# Altium schematic sheet fpga ram V0.SchDoc
size A4; Organization: Blinkinlabs, LLC
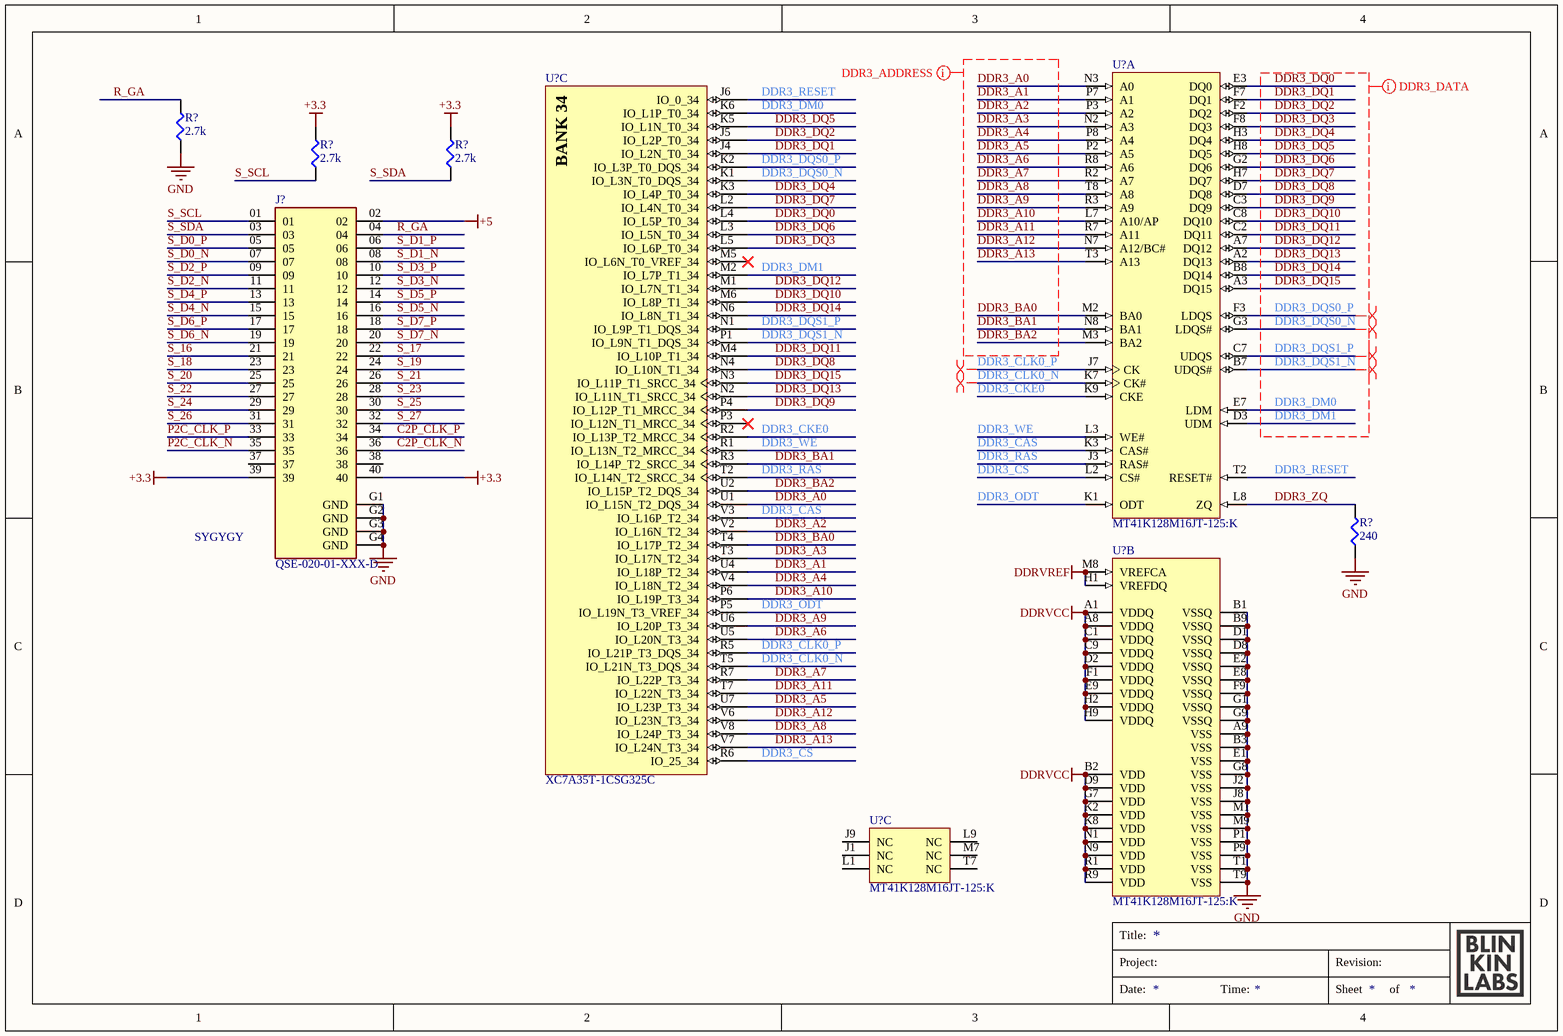
[diagram p0: fpga ram V0.SchDoc]

## Parts
(Parts that share a designator on the sheet are numbered #1, #2 ... from top to bottom, then left to right.)
J?  QSE-020-01-XXX-D  [SAMTEC_QSE-020-01-XXX-D]
R?#1  2.7k  [ERJ2G(0402)_L]
R?#2  2.7k  [ERJ2G(0402)_L]
R?#3  2.7k  [ERJ2G(0402)_L]
R?#4  240  [ERJ2G(0402)_L]
U?#1  MT41K128M16JT-125:K  [MICT-JT-96]  (part A of 3)
U?#2  XC7A35T-1CSG325C  [CSG325]  (part C of 9)
U?#3  MT41K128M16JT-125:K  [MICT-JT-96]  (part B of 3)
U?#4  MT41K128M16JT-125:K  [MICT-JT-96]  (part C of 3)

## Nets
+3.3: J?.39 J?.40 R?#2.2 R?#3.2
+5: J?.02
DDRVCC: U?#3.A1(VDDQ) U?#3.A8(VDDQ) U?#3.B2(VDD) U?#3.C1(VDDQ) U?#3.C9(VDDQ) U?#3.D2(VDDQ) U?#3.D9(VDD) U?#3.E9(VDDQ) U?#3.F1(VDDQ) U?#3.G7(VDD) U?#3.H2(VDDQ) U?#3.H9(VDDQ) U?#3.K2(VDD) U?#3.K8(VDD) U?#3.N1(VDD) U?#3.N9(VDD) U?#3.R1(VDD) U?#3.R9(VDD)
DDRVREF: U?#3.H1(VREFDQ) U?#3.M8(VREFCA)
GND: J?.G1(GND) J?.G2(GND) J?.G3(GND) J?.G4(GND) R?#1.1 R?#4.1 U?#3.A9(VSS) U?#3.B1(VSSQ) U?#3.B3(VSS) U?#3.B9(VSSQ) U?#3.D1(VSSQ) U?#3.D8(VSSQ) U?#3.E1(VSS) U?#3.E2(VSSQ) U?#3.E8(VSSQ) U?#3.F9(VSSQ) U?#3.G1(VSSQ) U?#3.G8(VSS) U?#3.G9(VSSQ) U?#3.J2(VSS) U?#3.J8(VSS) U?#3.M1(VSS) U?#3.M9(VSS) U?#3.P1(VSS) U?#3.P9(VSS) U?#3.T1(VSS) U?#3.T9(VSS)
C2P_CLK_N: J?.36
C2P_CLK_P: J?.34
DDR3_A0: U?#1.N3(A0) U?#2.U1(IO_L15N_T2_DQS_34)
DDR3_A1: U?#1.P7(A1) U?#2.U4(IO_L18P_T2_34)
DDR3_A2: U?#1.P3(A2) U?#2.V2(IO_L16N_T2_34)
DDR3_A3: U?#1.N2(A3) U?#2.T3(IO_L17N_T2_34)
DDR3_A4: U?#1.P8(A4) U?#2.V4(IO_L18N_T2_34)
DDR3_A5: U?#1.P2(A5) U?#2.U7(IO_L23P_T3_34)
DDR3_A6: U?#1.R8(A6) U?#2.U5(IO_L20N_T3_34)
DDR3_A7: U?#1.R2(A7) U?#2.R7(IO_L22P_T3_34)
DDR3_A8: U?#1.T8(A8) U?#2.V8(IO_L24P_T3_34)
DDR3_A9: U?#1.R3(A9) U?#2.U6(IO_L20P_T3_34)
DDR3_A10: U?#1.L7(A10/AP) U?#2.P6(IO_L19P_T3_34)
DDR3_A11: U?#1.R7(A11) U?#2.T7(IO_L22N_T3_34)
DDR3_A12: U?#1.N7(A12/BC#) U?#2.V6(IO_L23N_T3_34)
DDR3_A13: U?#1.T3(A13) U?#2.V7(IO_L24N_T3_34)
DDR3_BA0: U?#1.M2(BA0) U?#2.T4(IO_L17P_T2_34)
DDR3_BA1: U?#1.N8(BA1) U?#2.R3(IO_L14P_T2_SRCC_34)
DDR3_BA2: U?#1.M3(BA2) U?#2.U2(IO_L15P_T2_DQS_34)
DDR3_CAS: U?#1.K3(CAS#) U?#2.V3(IO_L16P_T2_34)
DDR3_CKE0: U?#1.K9(CKE) U?#2.R2(IO_L13P_T2_MRCC_34)
DDR3_CLK0_N: U?#1.K7(CK#) U?#2.T5(IO_L21N_T3_DQS_34)
DDR3_CLK0_P: U?#1.J7(CK) U?#2.R5(IO_L21P_T3_DQS_34)
DDR3_CS: U?#1.L2(CS#) U?#2.R6(IO_25_34)
DDR3_DM0: U?#1.E7(LDM) U?#2.K6(IO_L1P_T0_34)
DDR3_DM1: U?#1.D3(UDM) U?#2.M2(IO_L7P_T1_34)
DDR3_DQ0: U?#1.E3(DQ0) U?#2.L4(IO_L5P_T0_34)
DDR3_DQ1: U?#1.F7(DQ1) U?#2.J4(IO_L2N_T0_34)
DDR3_DQ2: U?#1.F2(DQ2) U?#2.J5(IO_L2P_T0_34)
DDR3_DQ3: U?#1.F8(DQ3) U?#2.L5(IO_L6P_T0_34)
DDR3_DQ4: U?#1.H3(DQ4) U?#2.K3(IO_L4P_T0_34)
DDR3_DQ5: U?#1.H8(DQ5) U?#2.K5(IO_L1N_T0_34)
DDR3_DQ6: U?#1.G2(DQ6) U?#2.L3(IO_L5N_T0_34)
DDR3_DQ7: U?#1.H7(DQ7) U?#2.L2(IO_L4N_T0_34)
DDR3_DQ8: U?#1.D7(DQ8) U?#2.N4(IO_L10N_T1_34)
DDR3_DQ9: U?#1.C3(DQ9) U?#2.P4(IO_L12P_T1_MRCC_34)
DDR3_DQ10: U?#1.C8(DQ10) U?#2.M6(IO_L8P_T1_34)
DDR3_DQ11: U?#1.C2(DQ11) U?#2.M4(IO_L10P_T1_34)
DDR3_DQ12: U?#1.A7(DQ12) U?#2.M1(IO_L7N_T1_34)
DDR3_DQ13: U?#1.A2(DQ13) U?#2.N2(IO_L11N_T1_SRCC_34)
DDR3_DQ14: U?#1.B8(DQ14) U?#2.N6(IO_L8N_T1_34)
DDR3_DQ15: U?#1.A3(DQ15) U?#2.N3(IO_L11P_T1_SRCC_34)
DDR3_DQS0_N: U?#1.G3(LDQS#) U?#2.K1(IO_L3N_T0_DQS_34)
DDR3_DQS0_P: U?#1.F3(LDQS) U?#2.K2(IO_L3P_T0_DQS_34)
DDR3_DQS1_N: U?#1.B7(UDQS#) U?#2.P1(IO_L9N_T1_DQS_34)
DDR3_DQS1_P: U?#1.C7(UDQS) U?#2.N1(IO_L9P_T1_DQS_34)
DDR3_ODT: U?#1.K1(ODT) U?#2.P5(IO_L19N_T3_VREF_34)
DDR3_RAS: U?#1.J3(RAS#) U?#2.T2(IO_L14N_T2_SRCC_34)
DDR3_RESET: U?#1.T2(RESET#) U?#2.J6(IO_0_34)
DDR3_WE: U?#1.L3(WE#) U?#2.R1(IO_L13N_T2_MRCC_34)
DDR3_ZQ: R?#4.2 U?#1.L8(ZQ)
P2C_CLK_N: J?.35
P2C_CLK_P: J?.33
R_GA: J?.04 R?#1.2
S_16: J?.21
S_17: J?.22
S_18: J?.23
S_19: J?.24
S_20: J?.25
S_21: J?.26
S_22: J?.27
S_23: J?.28
S_24: J?.29
S_25: J?.30
S_26: J?.31
S_27: J?.32
S_D0_N: J?.07
S_D0_P: J?.05
S_D1_N: J?.08
S_D1_P: J?.06
S_D2_N: J?.11
S_D2_P: J?.09
S_D3_N: J?.12
S_D3_P: J?.10
S_D4_N: J?.15
S_D4_P: J?.13
S_D5_N: J?.16
S_D5_P: J?.14
S_D6_N: J?.19
S_D6_P: J?.17
S_D7_N: J?.20
S_D7_P: J?.18
S_SCL: J?.01 R?#2.1
S_SDA: J?.03 R?#3.1

Not connected (* = marked no-connect by the designer): J? 37 38; U?#2 M5(IO_L6N_T0_VREF_34)* P3(IO_L12N_T1_MRCC_34)*; U?#4 J1(NC) J9(NC) L1(NC) L9(NC) M7(NC) T7(NC)

## Layout directives
net class DDR3_ADDRESS: DDR3_A0, DDR3_A1, DDR3_A2, DDR3_A3, DDR3_A4, DDR3_A5, DDR3_A6, DDR3_A7, DDR3_A8, DDR3_A9, DDR3_A10, DDR3_A11, DDR3_A12, DDR3_A13, DDR3_BA0, DDR3_BA1, DDR3_BA2
net class DDR3_DATA; rule Matched Net Lengths [Delay Tolerance = 15ps]; rule Impedance Constraint [Min = 50.00    Max = 50.00    ]: DDR3_DM0, DDR3_DM1, DDR3_DQ0, DDR3_DQ1, DDR3_DQ2, DDR3_DQ3, DDR3_DQ4, DDR3_DQ5, DDR3_DQ6, DDR3_DQ7, DDR3_DQ8, DDR3_DQ9, DDR3_DQ10, DDR3_DQ11, DDR3_DQ12, DDR3_DQ13, DDR3_DQ14, DDR3_DQ15, DDR3_DQS0_N, DDR3_DQS0_P, DDR3_DQS1_N, DDR3_DQS1_P
differential pair: DDR3_CLK0_N, DDR3_CLK0_P, DDR3_DQS0_N, DDR3_DQS0_P, DDR3_DQS1_N, DDR3_DQS1_P

## Notes on the sheet
- (near J?) SYGYGY
- Title:
- Project:
- Revision:
- Date:
- Time:
- Sheet
- of
- (in symbol CMP-0383-00016-1, part C) BANK 34

## Library data of the parts
J? = QSE-020-01-XXX-D: 40 Position Connector Receptacle, Center Strip Contacts Surface Mount Gold; MF: Samtec; MP: QSE-020-01-F-D; SnapEDA_Link: https://www.snapeda.com/parts/QSE-020-01-F-D/Samtec/view-part/1737145/?ref=snap; Value: *; Availability: Bad; Price: None; Toby_UK-Purchase-URL: https://snapeda.com/shop?store=Toby+UK&id=1737145; Package: MAPBGA-624 Samtec
R?#1-R?#3 = ERJ-2RKF2701X: RES SMD 2.7K OHM 1% 1/10W 0402; Manufacturer: Panasonic Electronic Components; Power (Watts): 0.1W, 1/10W; Temperature Coefficient: ±100ppm/°C; PartNumber: ERJ-2RKF2701X; Datasheets: http://industrial.panasonic.com/www-cgi/jvcr13pz.cgi?E+PZ+3+AOA0002+ERJ2RKF2701X+7+WW; Image: //media.digikey.com/Photos/Panasonic%20Photos/ERJ-PA2-Series.jpg; Digi-Key Part Number: P2.70KLCT-ND; Series: ERJ; Value: 2.7k; Tolerance: ±1%; Composition: Thick Film; Features: Automotive AEC-Q200; Operating Temperature: -55°C ~ 155°C; Package / Case: 0402 (1005 Metric); Case/Package: 0402; Size / Dimension: 0.039" L x 0.020" W (1.00mm x 0.50mm); Height - Seated (Max): 0.016" (0.40mm); Number of Terminations: 2
R?#4 = ERJ-2RKF2400X: RES SMD 240 OHM 1% 1/10W 0402; Manufacturer: Panasonic Electronic Components; Power (Watts): 0.1W, 1/10W; Temperature Coefficient: ±100ppm/°C; PartNumber: ERJ-2RKF2400X; Datasheets: http://industrial.panasonic.com/www-cgi/jvcr13pz.cgi?E+PZ+3+AOA0002+ERJ2RKF2400X+7+WW; Image: //media.digikey.com/Photos/Panasonic%20Photos/ERJ-PA2-Series.jpg; Digi-Key Part Number: P240LCT-ND; Series: ERJ; Value: 240; Tolerance: ±1%; Composition: Thick Film; Features: Automotive AEC-Q200; Operating Temperature: -55°C ~ 155°C; Package / Case: 0402 (1005 Metric); Case/Package: 0402; Size / Dimension: 0.039" L x 0.020" W (1.00mm x 0.50mm); Height - Seated (Max): 0.016" (0.40mm); Number of Terminations: 2
U?#1 U?#3 U?#4 = CMP-2000-04975-1: 2Gb DDR3-1600 SDRAM, 128Mb x 16, 1.25 ns, 1.35 V, 0 to 95 degC, 96-Ball FBGA; Manufacturer: Micron; Density: 2147483648Bit; Organization: 128Mx16; Supply Current: 138mA; Maximum Clock Rate: 1600MHz; Operating Supply Voltage (Min): 1.283V; Address Bus: 17b; Operating Supply Voltage (Typ): 1.35V; Operating Supply Voltage (Max): 1.45V; Rad Hardened: No; Manufacturer URL: https://www.micron.com/; Type: DDR3LSDRAM; Package Description: 96-Ball Ball Grid Array, Body 14 x 8 mm, Pitch 0.8 mm; Operating Temp Range: 0Cto95C; Pin Count: 96; Package Reference: JT-96; Operating Temperature Classification: Commercial; Mounting: SurfaceMount; Datasheet URL: http://download.siliconexpert.com/pdfs/2013/11/24/21/35/34/146/mic_/manual/272gb_1_35v_ddr3l.pdf; Datasheet Version: Rev. K , 09/2013; Package Type: FBGA
U?#2 = CMP-0383-00016-1: Artix-7 FPGA, 150 User I/Os, 4 GTP, 324-Ball BGA, Speed Grade 1, Commercial Grade, Pb-Free; Manufacturer: Xilinx; Total Block RAM: 1800 Kb; Speed Grades: 1; Available User I/O: 150; GTP: 4; Logic Cells: 33280; CMTs: 5; ComponentLink3URL: http://www.xilinx.com/support/documentation/user_guides/ug475_7Series_Pkg_Pinout.pdf; PackageVersion: Rev. 1.11; PackageDescription: 324-Ball Wire-Bond Chip-Scale BGA, Body 15 x 15 mm, Pitch 0.8 mm; Maximum Distributed RAM: 400 Kb; ComponentLink2URL: http://www.xilinx.com/support/documentation/data_sheets/ds180_7Series_Overview.pdf; PartNumber: XC7A35T-1CSG325C; Mounting Technology: Surface Mount; Operating Temperature Range: Commercial; DatasheetVersion: Rev. 1.15; ComponentLink2Description: Datasheet; PackageReference: CSG-325; ComponentLink4URL: http://www.xilinx.com/support/documentation/user_guides/ug475_7Series_Pkg_Pinout.pdf; ComponentLink1URL: http://www.xilinx.com/; ComponentLink1Description: Manufacturer URL; ComponentLink3Description: Pinout; ComponentLink4Description: Package Specification